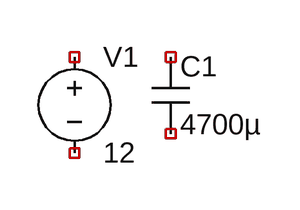
[diagram p0: schematic test-schematic.asc]
test-schematic.asc, the LTspice schematic file:
Version 4
SHEET 1 1548 680
SYMBOL voltage -48 160 R0
WINDOW 123 0 0 Left 0
WINDOW 39 0 0 Left 0
SYMATTR InstName V1
SYMATTR Value 12
SYMBOL cap 16 176 R0
SYMATTR InstName C1
SYMATTR Value 4700µ

The netlist it stands for:
* test-schematic.asc
V1 NC_01 NC_02 12
C1 NC_03 NC_04 4700µ
.backanno
.end